# Altium project B100AA Development Kit.PrjPcb (part 3 of 5)

## Sheet Digital Port K Button.SchDoc: PORT State Change Buttons
size A4; ApprovedBy: Mehmet Günce Akkoyun; CheckedBy: Mehmet Günce Akkoyun; Author: Mehmet Günce Akkoyun; CompanyName: Ovoo Electronics; DrawnBy: Mehmet Günce Akkoyun; Engineer: Mehmet Günce Akkoyun; Organization: Ovoo Electronics; Address1: Necip Fazýl Mah. Ortaýrmak Sok.; Address2: Birgül Apt. No: 19/6; Address3: Meram / Konya; Address4: Turkiye; DocumentNumber: AA001; Revision: B100AA Dev Kit
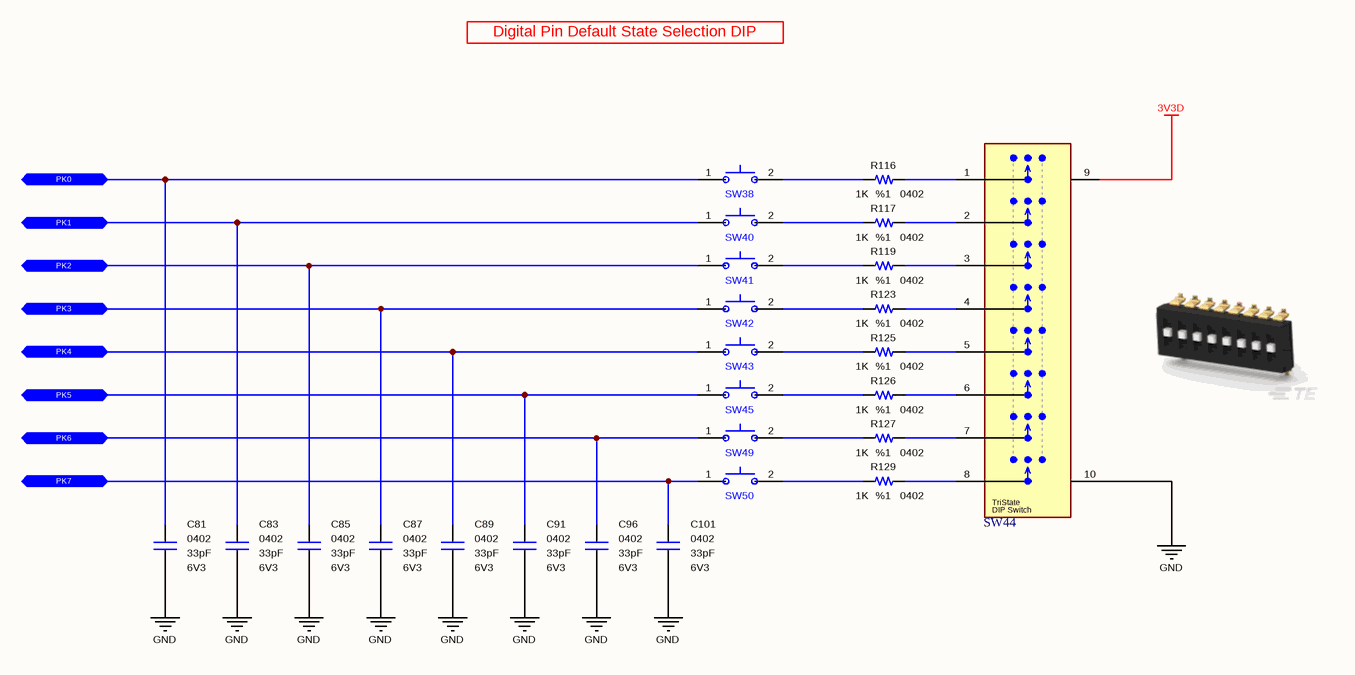
[diagram p17: Digital Port K Button.SchDoc]

### Parts
C81  value 33pF  Case: 0402  Voltage: 6V3  [CAPACITOR_0402]  (hidden comment: Multilayer Ceramic Capacitor)
C83  value 33pF  Case: 0402  Voltage: 6V3  [CAPACITOR_0402]  (hidden comment: Multilayer Ceramic Capacitor)
C85  value 33pF  Case: 0402  Voltage: 6V3  [CAPACITOR_0402]  (hidden comment: Multilayer Ceramic Capacitor)
C87  value 33pF  Case: 0402  Voltage: 6V3  [CAPACITOR_0402]  (hidden comment: Multilayer Ceramic Capacitor)
C89  value 33pF  Case: 0402  Voltage: 6V3  [CAPACITOR_0402]  (hidden comment: Multilayer Ceramic Capacitor)
C91  value 33pF  Case: 0402  Voltage: 6V3  [CAPACITOR_0402]  (hidden comment: Multilayer Ceramic Capacitor)
C96  value 33pF  Case: 0402  Voltage: 6V3  [CAPACITOR_0402]  (hidden comment: Multilayer Ceramic Capacitor)
C101  value 33pF  Case: 0402  Voltage: 6V3  [CAPACITOR_0402]  (hidden comment: Multilayer Ceramic Capacitor)
R116  value 1K  Tolerance: %1  Case: 0402  [RESISTOR_0402]  (hidden comment: Thick Film Resistor)
R117  value 1K  Tolerance: %1  Case: 0402  [RESISTOR_0402]  (hidden comment: Thick Film Resistor)
R119  value 1K  Tolerance: %1  Case: 0402  [RESISTOR_0402]  (hidden comment: Thick Film Resistor)
R123  value 1K  Tolerance: %1  Case: 0402  [RESISTOR_0402]  (hidden comment: Thick Film Resistor)
R125  value 1K  Tolerance: %1  Case: 0402  [RESISTOR_0402]  (hidden comment: Thick Film Resistor)
R126  value 1K  Tolerance: %1  Case: 0402  [RESISTOR_0402]  (hidden comment: Thick Film Resistor)
R127  value 1K  Tolerance: %1  Case: 0402  [RESISTOR_0402]  (hidden comment: Thick Film Resistor)
R129  value 1K  Tolerance: %1  Case: 0402  [RESISTOR_0402]  (hidden comment: Thick Film Resistor)
SW38  Tactile Switches  [PTS526_Switch]  (value not drawn)
SW40  Tactile Switches  [PTS526_Switch]  (value not drawn)
SW41  Tactile Switches  [PTS526_Switch]  (value not drawn)
SW42  Tactile Switches  [PTS526_Switch]  (value not drawn)
SW43  Tactile Switches  [PTS526_Switch]  (value not drawn)
SW44  DIP Switches/SIP Switches  [TDS08SGNNTR04]  (value not drawn)
SW45  Tactile Switches  [PTS526_Switch]  (value not drawn)
SW49  Tactile Switches  [PTS526_Switch]  (value not drawn)
SW50  Tactile Switches  [PTS526_Switch]  (value not drawn)

### Ports
PK0 (bidir), PK1 (bidir), PK2 (bidir), PK3 (bidir), PK4 (bidir), PK5 (bidir), PK6 (bidir), PK7 (bidir)

### Nets
3V3D: SW44.9(VCC)
GND: C81.1 C83.1 C85.1 C87.1 C89.1 C91.1 C96.1 C101.1 SW44.10(GND)
PK0: C81.2 SW38.1(NC) ; port PK0
PK1: C83.2 SW40.1(NC) ; port PK1
PK2: C85.2 SW41.1(NC) ; port PK2
PK3: C87.2 SW42.1(NC) ; port PK3
PK4: C89.2 SW43.1(NC) ; port PK4
PK5: C91.2 SW45.1(NC) ; port PK5
PK6: C96.2 SW49.1(NC) ; port PK6
PK7: C101.2 SW50.1(NC) ; port PK7
NetR116_1: R116.1 SW44.1
NetR116_2: R116.2 SW38.2(COM)
NetR117_1: R117.1 SW44.2
NetR117_2: R117.2 SW40.2(COM)
NetR119_1: R119.1 SW44.3
NetR119_2: R119.2 SW41.2(COM)
NetR123_1: R123.1 SW44.4
NetR123_2: R123.2 SW42.2(COM)
NetR125_1: R125.1 SW44.5
NetR125_2: R125.2 SW43.2(COM)
NetR126_1: R126.1 SW44.6
NetR126_2: R126.2 SW45.2(COM)
NetR127_1: R127.1 SW44.7
NetR127_2: R127.2 SW49.2(COM)
NetR129_1: R129.1 SW44.8
NetR129_2: R129.2 SW50.2(COM)

### Notes on the sheet
- Digital Pin Default State Selection DIP
- Title
- Size:
- Date:
- A4
- Number:
- Time:
- Revision:
- Sheet
- of
- File:
- (in symbol Switch - DIP Switch (8 Pole TriState)) TriState; DIP Switch

### Library data of the parts
C81 C83 C85 C87 C89 C91 C96 C101 = Capacitor - 33pF [0402-6V3]: as C50 on sheet Digital Port F State LED Inducator; Height: 0.5mm; Mouser Part Number: 80-C0402C330J9RAUTO; Maximum Operating Temperature: +125; Minimum Operating Temperature: -55; ROHS: Yes; ComponentLink1Description: DataSheet; ComponentLink1URL: https://api.kemet.com/component-edge/download/datasheet/C0402C330J9RACAUTO.pdf; ComponentLink2Description: Mouser; ComponentLink2URL: https://www.mouser.com/Search/Refine.aspx?Keyword=80-C0402C330J9RAUTO; Supplier 1: Mouser; Supplier Part Number 1: 80-C0402C330J9RAUTO
R116 R117 R119 R123 R125-R127 R129 = Resistor - 1K: Thick Film Resistors - SMD 1/16 W 1.0 Kohms 1%; Manufacturer Name: Vishay; Manufacturer Part Number: CRCW04021K00FKED; Height: 0.35mm; Mouser Part Number: 71-CRCW0402-1.0K-E3; ComponentLink1Description: DataSheet; ComponentLink1URL: https://www.mouser.com.tr/datasheet/2/427/dcrcwe3-1762152.pdf; ComponentLink2Description: Mouser; ComponentLink2URL: https://www.mouser.com.tr/ProductDetail/Vishay-Dale/CRCW04021K00FKED?qs=sGAEpiMZZMu61qfTUdNhG2DpbjADlD3GFJ4zSbeLqG8%3D; Supplier 1: Mouser; Supplier 2: Digi-Key; Supplier Part Number 1: 71-CRCW0402-1.0K-E3; Supplier Part Number 2: 541-1.00KLCT-ND
SW38 SW40-SW43 SW45 SW49 SW50 = Switch - Tactile: as SW28 on sheet Digital Port F Button; Height: 0.8mm; Mouser Part Number: 611-PTS526SK08SMTR2L; ComponentLink1Description: DataSheet; ComponentLink1URL: https://eu.mouser.com/datasheet/2/60/pts526-1651200.pdf; ComponentLink2Description: Mouser; ComponentLink2URL: https://eu.mouser.com/ProductDetail/CK/PTS526-SK08-SMTR2-LFS?qs=sGAEpiMZZMsgGjVA3toVBL%2FRce%252ByN3s1hQPqiLlQ%252BeM%3D; Supplier 1: Future Electronics; Supplier 2: Mouser; Supplier 3: Arrow; Supplier 4: Digi-Key; Supplier Part Number 1: PTS526SK08SMTR2LFS-REEL; Supplier Part Number 2: 611-PTS526SK08SMTR2L; Supplier Part Number 3: PTS526 SK08 SMTR2 LFS; Supplier Part Number 4: CKN12219-1-ND
SW44 = Switch - DIP Switch (8 Pole TriState): DIP Switches/SIP Switches TRI-STATE DIP 8P G RAISED T&R; Manufacturer Name: TE Connectivity; Manufacturer Part Number: TDS08SGNNTR04; Mouser Part Number: 506-TDS08SGNNTR04; ComponentLink1Description: DataSheet; ComponentLink1URL: https://www.mouser.com.tr/datasheet/2/418/4/NG_DS_1-1773931-8_ALCOSWITCH_DIP_TDS_0917-1221113.pdf; ComponentLink2Description: Mouser; ComponentLink2URL: https://www.mouser.com.tr/ProductDetail/TE-Connectivity-Alcoswitch/TDS08SGNNTR04/?qs=wd5RIQLrsJiLOOX2pWoyQw==

## Sheet Digital Port L.SchDoc: Port L Digital Control
size A4; ApprovedBy: Mehmet Günce Akkoyun; CheckedBy: Mehmet Günce Akkoyun; Author: Mehmet Günce Akkoyun; CompanyName: Ovoo Electronics; DrawnBy: Mehmet Günce Akkoyun; Engineer: Mehmet Günce Akkoyun; Organization: Ovoo Electronics; Address1: Necip Fazýl Mah. Ortaýrmak Sok.; Address2: Birgül Apt. No: 19/6; Address3: Meram / Konya; Address4: Turkiye; DocumentNumber: AA001; Revision: B100AA Dev Kit
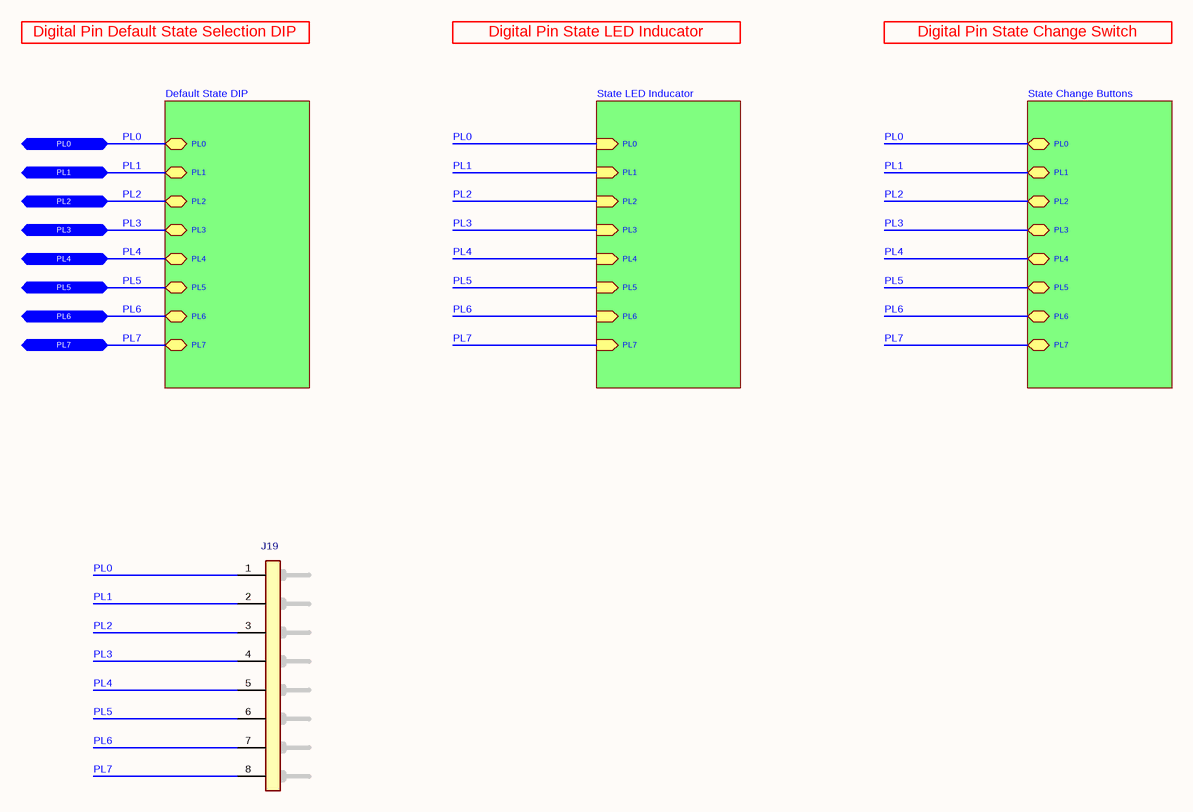
[diagram p18: Digital Port L.SchDoc]

### Parts
J19  2.54 mm Pitch 8P Male Connector  [8P Header]  (value not drawn)

### Sub-sheets
Default State DIP = Digital Port L Default State DIP.SchDoc: PL1 (bidir), PL0 (bidir), PL7 (bidir), PL4 (bidir), PL6 (bidir), PL3 (bidir), PL5 (bidir), PL2 (bidir)
State Change Buttons = Digital Port L Button.SchDoc: PL1 (bidir), PL0 (bidir), PL7 (bidir), PL4 (bidir), PL6 (bidir), PL3 (bidir), PL5 (bidir), PL2 (bidir)
State LED Inducator = Digital Port L State LED Inducator.SchDoc: PL1 (in), PL0 (in), PL7 (in), PL4 (in), PL6 (in), PL3 (in), PL5 (in), PL2 (in)

### Ports
PL0 (bidir), PL1 (bidir), PL2 (bidir), PL3 (bidir), PL4 (bidir), PL5 (bidir), PL6 (bidir), PL7 (bidir)

### Nets
PL0: J19.1(Pin-1) ; port PL0, sheet Default State DIP/PL0, sheet State LED Inducator/PL0, sheet State Change Buttons/PL0
PL1: J19.2(Pin-2) ; port PL1, sheet Default State DIP/PL1, sheet State LED Inducator/PL1, sheet State Change Buttons/PL1
PL2: J19.3(Pin-3) ; port PL2, sheet Default State DIP/PL2, sheet State LED Inducator/PL2, sheet State Change Buttons/PL2
PL3: J19.4(Pin-4) ; port PL3, sheet Default State DIP/PL3, sheet State LED Inducator/PL3, sheet State Change Buttons/PL3
PL4: J19.5(Pin-5) ; port PL4, sheet Default State DIP/PL4, sheet State LED Inducator/PL4, sheet State Change Buttons/PL4
PL5: J19.6(Pin-6) ; port PL5, sheet Default State DIP/PL5, sheet State LED Inducator/PL5, sheet State Change Buttons/PL5
PL6: J19.7(Pin-7) ; port PL6, sheet Default State DIP/PL6, sheet State LED Inducator/PL6, sheet State Change Buttons/PL6
PL7: J19.8(Pin-8) ; port PL7, sheet Default State DIP/PL7, sheet State LED Inducator/PL7, sheet State Change Buttons/PL7

### Notes on the sheet
- Digital Pin Default State Selection DIP
- Digital Pin State LED Inducator
- Digital Pin State Change Switch
- Title
- Size:
- Date:
- A4
- Number:
- Time:
- Revision:
- Sheet
- of
- File:

### Library data of the parts
J19 = Connector - Male Header 8P (2.54): Headers & Wire Housings BREAKAWAY HDR VERT 8; Manufacturer Name: Molex; Position: 8; Row: 1; Pitch: 2.54 mm; Manufacturer Part Number: 22-28-4083; Mouser Part Number: 538-22-28-4083; ROHS: Yes; ComponentLink1Description: DataSheet; ComponentLink1URL: https://www.mouser.com.tr/datasheet/2/276/0022284063_PCB_HEADERS-228265.pdf; ComponentLink2Description: Mouser; ComponentLink2URL: https://www.mouser.com.tr/ProductDetail/Molex/22-28-4083/?qs=%2Fha2pyFaduguMWEp6M%252Bj0x6fHxUvnRGD%252BIxBoa6MO5w%3D

## Sheet Digital Port L Default State DIP.SchDoc: PORT L Default State Selection Switch
size A4; ApprovedBy: Mehmet Günce Akkoyun; CheckedBy: Mehmet Günce Akkoyun; Author: Mehmet Günce Akkoyun; CompanyName: Ovoo Electronics; DrawnBy: Mehmet Günce Akkoyun; Engineer: Mehmet Günce Akkoyun; Organization: Ovoo Electronics; Address1: Necip Fazýl Mah. Ortaýrmak Sok.; Address2: Birgül Apt. No: 19/6; Address3: Meram / Konya; Address4: Turkiye; DocumentNumber: AA001; Revision: B100AA Dev Kit
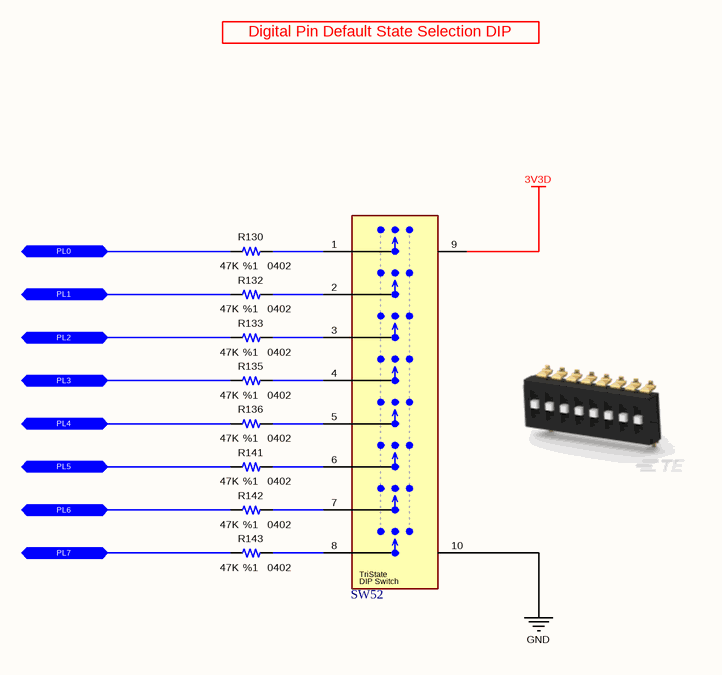
[diagram p19: Digital Port L Default State DIP.SchDoc]

### Parts
R130  value 47K  Tolerance: %1  Case: 0402  [RESISTOR_0402]  (hidden comment: Thick Film Resistor)
R132  value 47K  Tolerance: %1  Case: 0402  [RESISTOR_0402]  (hidden comment: Thick Film Resistor)
R133  value 47K  Tolerance: %1  Case: 0402  [RESISTOR_0402]  (hidden comment: Thick Film Resistor)
R135  value 47K  Tolerance: %1  Case: 0402  [RESISTOR_0402]  (hidden comment: Thick Film Resistor)
R136  value 47K  Tolerance: %1  Case: 0402  [RESISTOR_0402]  (hidden comment: Thick Film Resistor)
R141  value 47K  Tolerance: %1  Case: 0402  [RESISTOR_0402]  (hidden comment: Thick Film Resistor)
R142  value 47K  Tolerance: %1  Case: 0402  [RESISTOR_0402]  (hidden comment: Thick Film Resistor)
R143  value 47K  Tolerance: %1  Case: 0402  [RESISTOR_0402]  (hidden comment: Thick Film Resistor)
SW52  DIP Switches/SIP Switches  [TDS08SGNNTR04]  (value not drawn)

### Ports
PL0 (bidir), PL1 (bidir), PL2 (bidir), PL3 (bidir), PL4 (bidir), PL5 (bidir), PL6 (bidir), PL7 (bidir)

### Nets
3V3D: SW52.9(VCC)
GND: SW52.10(GND)
PL0: R130.2 ; port PL0
PL1: R132.2 ; port PL1
PL2: R133.2 ; port PL2
PL3: R135.2 ; port PL3
PL4: R136.2 ; port PL4
PL5: R141.2 ; port PL5
PL6: R142.2 ; port PL6
PL7: R143.2 ; port PL7
NetR130_1: R130.1 SW52.1
NetR132_1: R132.1 SW52.2
NetR133_1: R133.1 SW52.3
NetR135_1: R135.1 SW52.4
NetR136_1: R136.1 SW52.5
NetR141_1: R141.1 SW52.6
NetR142_1: R142.1 SW52.7
NetR143_1: R143.1 SW52.8

### Notes on the sheet
- Digital Pin Default State Selection DIP
- Title
- Size:
- Date:
- A4
- Number:
- Time:
- Revision:
- Sheet
- of
- File:
- (in symbol Switch - DIP Switch (8 Pole TriState)) TriState; DIP Switch

### Library data of the parts
R130 R132 R133 R135 R136 R141-R143 = Resistor - 47K: Thick Film Resistors - SMD 1/16 W 47 Kohms 1%; Manufacturer Name: Vishay; Manufacturer Part Number: CRCW040247K0FKED; Height: 0.4mm; Mouser Part Number: 71-CRCW0402-47K-E3; ComponentLink1Description: DataSheet; ComponentLink1URL: https://www.mouser.com.tr/datasheet/2/427/dcrcwe3-1762152.pdf; ComponentLink2Description: Mouser; ComponentLink2URL: https://www.mouser.com.tr/ProductDetail/Vishay-Dale/CRCW040247K0FKED?qs=sGAEpiMZZMu61qfTUdNhG2DpbjADlD3GL%252B3h1elTxqU%3D; Supplier 1: Mouser; Supplier 2: Digi-Key; Supplier Part Number 1: 71-CRCW040247K0FKEDH; Supplier Part Number 2: 541-47.0KYCT-ND
SW52 = Switch - DIP Switch (8 Pole TriState): as SW44 on sheet Digital Port K Button; Manufacturer Part Number: TDS08SGNNTR04; Mouser Part Number: 506-TDS08SGNNTR04; ComponentLink1Description: DataSheet; ComponentLink1URL: https://www.mouser.com.tr/datasheet/2/418/4/NG_DS_1-1773931-8_ALCOSWITCH_DIP_TDS_0917-1221113.pdf; ComponentLink2Description: Mouser; ComponentLink2URL: https://www.mouser.com.tr/ProductDetail/TE-Connectivity-Alcoswitch/TDS08SGNNTR04/?qs=wd5RIQLrsJiLOOX2pWoyQw==

## Sheet Digital Port L State LED Inducator.SchDoc: PORT State LED Inducator
size A3; ApprovedBy: Mehmet Günce Akkoyun; CheckedBy: Mehmet Günce Akkoyun; Author: Mehmet Günce Akkoyun; CompanyName: Ovoo Electronics; DrawnBy: Mehmet Günce Akkoyun; Engineer: Mehmet Günce Akkoyun; Organization: Ovoo Electronics; Address1: Necip Fazýl Mah. Ortaýrmak Sok.; Address2: Birgül Apt. No: 19/6; Address3: Meram / Konya; Address4: Turkiye; DocumentNumber: AA001; Revision: B100AA Dev Kit
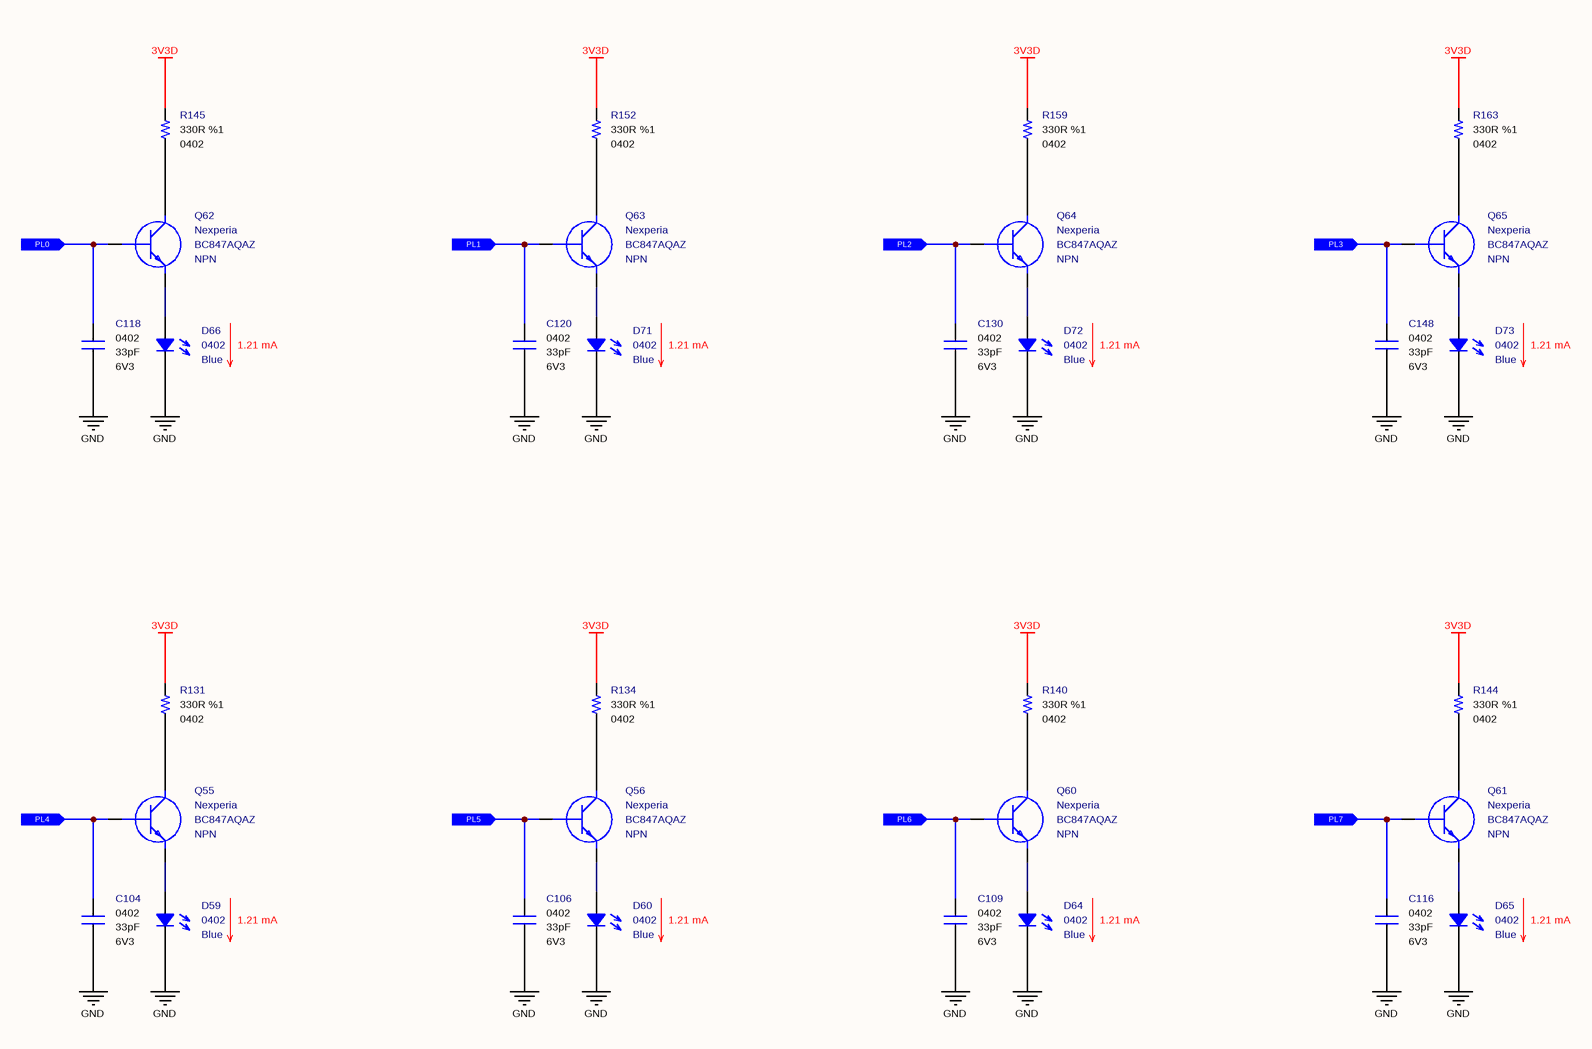
[diagram p20: Digital Port L State LED Inducator.SchDoc]

### Parts
C104  value 33pF  Case: 0402  Voltage: 6V3  [CAPACITOR_0402]  (hidden comment: Multilayer Ceramic Capacitor)
C106  value 33pF  Case: 0402  Voltage: 6V3  [CAPACITOR_0402]  (hidden comment: Multilayer Ceramic Capacitor)
C109  value 33pF  Case: 0402  Voltage: 6V3  [CAPACITOR_0402]  (hidden comment: Multilayer Ceramic Capacitor)
C116  value 33pF  Case: 0402  Voltage: 6V3  [CAPACITOR_0402]  (hidden comment: Multilayer Ceramic Capacitor)
C118  value 33pF  Case: 0402  Voltage: 6V3  [CAPACITOR_0402]  (hidden comment: Multilayer Ceramic Capacitor)
C120  value 33pF  Case: 0402  Voltage: 6V3  [CAPACITOR_0402]  (hidden comment: Multilayer Ceramic Capacitor)
C130  value 33pF  Case: 0402  Voltage: 6V3  [CAPACITOR_0402]  (hidden comment: Multilayer Ceramic Capacitor)
C148  value 33pF  Case: 0402  Voltage: 6V3  [CAPACITOR_0402]  (hidden comment: Multilayer Ceramic Capacitor)
D59  Case: 0402  Color: Blue  [LED_0402]  (hidden comment: SMD LED (Blue))
D60  Case: 0402  Color: Blue  [LED_0402]  (hidden comment: SMD LED (Blue))
D64  Case: 0402  Color: Blue  [LED_0402]  (hidden comment: SMD LED (Blue))
D65  Case: 0402  Color: Blue  [LED_0402]  (hidden comment: SMD LED (Blue))
D66  Case: 0402  Color: Blue  [LED_0402]  (hidden comment: SMD LED (Blue))
D71  Case: 0402  Color: Blue  [LED_0402]  (hidden comment: SMD LED (Blue))
D72  Case: 0402  Color: Blue  [LED_0402]  (hidden comment: SMD LED (Blue))
D73  Case: 0402  Color: Blue  [LED_0402]  (hidden comment: SMD LED (Blue))
Q55  Manufacturer_Name: Nexperia  Manufacturer_Part_Number: BC847AQAZ  Polarity: NPN  [SOT1215]  (hidden comment: Bipolar NPN Transistors)
Q56  Manufacturer_Name: Nexperia  Manufacturer_Part_Number: BC847AQAZ  Polarity: NPN  [SOT1215]  (hidden comment: Bipolar NPN Transistors)
Q60  Manufacturer_Name: Nexperia  Manufacturer_Part_Number: BC847AQAZ  Polarity: NPN  [SOT1215]  (hidden comment: Bipolar NPN Transistors)
Q61  Manufacturer_Name: Nexperia  Manufacturer_Part_Number: BC847AQAZ  Polarity: NPN  [SOT1215]  (hidden comment: Bipolar NPN Transistors)
Q62  Manufacturer_Name: Nexperia  Manufacturer_Part_Number: BC847AQAZ  Polarity: NPN  [SOT1215]  (hidden comment: Bipolar NPN Transistors)
Q63  Manufacturer_Name: Nexperia  Manufacturer_Part_Number: BC847AQAZ  Polarity: NPN  [SOT1215]  (hidden comment: Bipolar NPN Transistors)
Q64  Manufacturer_Name: Nexperia  Manufacturer_Part_Number: BC847AQAZ  Polarity: NPN  [SOT1215]  (hidden comment: Bipolar NPN Transistors)
Q65  Manufacturer_Name: Nexperia  Manufacturer_Part_Number: BC847AQAZ  Polarity: NPN  [SOT1215]  (hidden comment: Bipolar NPN Transistors)
R131  value 330R  Tolerance: %1  Case: 0402  [RESISTOR_0402]  (hidden comment: Thick Film Resistor)
R134  value 330R  Tolerance: %1  Case: 0402  [RESISTOR_0402]  (hidden comment: Thick Film Resistor)
R140  value 330R  Tolerance: %1  Case: 0402  [RESISTOR_0402]  (hidden comment: Thick Film Resistor)
R144  value 330R  Tolerance: %1  Case: 0402  [RESISTOR_0402]  (hidden comment: Thick Film Resistor)
R145  value 330R  Tolerance: %1  Case: 0402  [RESISTOR_0402]  (hidden comment: Thick Film Resistor)
R152  value 330R  Tolerance: %1  Case: 0402  [RESISTOR_0402]  (hidden comment: Thick Film Resistor)
R159  value 330R  Tolerance: %1  Case: 0402  [RESISTOR_0402]  (hidden comment: Thick Film Resistor)
R163  value 330R  Tolerance: %1  Case: 0402  [RESISTOR_0402]  (hidden comment: Thick Film Resistor)

### Ports
PL0 (in), PL1 (in), PL2 (in), PL3 (in), PL4 (in), PL5 (in), PL6 (in), PL7 (in)

### Nets
3V3D: R131.2 R134.2 R140.2 R144.2 R145.2 R152.2 R159.2 R163.2
GND: C104.2 C106.2 C109.2 C116.2 C118.2 C120.2 C130.2 C148.2 D59.1 D60.1 D64.1 D65.1 D66.1 D71.1 D72.1 D73.1
PL0: C118.1 Q62.1(B) ; port PL0
PL1: C120.1 Q63.1(B) ; port PL1
PL2: C130.1 Q64.1(B) ; port PL2
PL3: C148.1 Q65.1(B) ; port PL3
PL4: C104.1 Q55.1(B) ; port PL4
PL5: C106.1 Q56.1(B) ; port PL5
PL6: C109.1 Q60.1(B) ; port PL6
PL7: C116.1 Q61.1(B) ; port PL7
NetD59_2: D59.2 Q55.2(E)
NetD60_2: D60.2 Q56.2(E)
NetD64_2: D64.2 Q60.2(E)
NetD65_2: D65.2 Q61.2(E)
NetD66_2: D66.2 Q62.2(E)
NetD71_2: D71.2 Q63.2(E)
NetD72_2: D72.2 Q64.2(E)
NetD73_2: D73.2 Q65.2(E)
NetQ55_3: Q55.3(C) R131.1
NetQ56_3: Q56.3(C) R134.1
NetQ60_3: Q60.3(C) R140.1
NetQ61_3: Q61.3(C) R144.1
NetQ62_3: Q62.3(C) R145.1
NetQ63_3: Q63.3(C) R152.1
NetQ64_3: Q64.3(C) R159.1
NetQ65_3: Q65.3(C) R163.1

### Notes on the sheet
- 1.21 mA
- Title
- Size:
- Date:
- A3
- Number:
- Time:
- Revision:
- Sheet
- of
- File:

### Library data of the parts
C104 C106 C109 C116 C118 C120 C130 C148 = Capacitor - 33pF [0402-6V3]: as C50 on sheet Digital Port F State LED Inducator; Height: 0.5mm; Maximum Operating Temperature: +125; Minimum Operating Temperature: -55; ROHS: Yes; ComponentLink1Description: DataSheet; ComponentLink1URL: https://api.kemet.com/component-edge/download/datasheet/C0402C330J9RACAUTO.pdf; ComponentLink2Description: Mouser; ComponentLink2URL: https://www.mouser.com/Search/Refine.aspx?Keyword=80-C0402C330J9RAUTO; Supplier 1: Mouser; Supplier Part Number 1: 80-C0402C330J9RAUTO; Mouser Part Number: 80-C0402C330J9RAUTO
D59 D60 D64-D66 D71-D73 = Diode - LED (0402-Blue): as D29 on sheet Digital Port F State LED Inducator; Mouser_Part_Number: 755-SMLP13BC8TT86; ROHS: Yes; ComponentLink1Description: DataSheet; ComponentLink1URL: https://d1d2qsbl8m0m72.cloudfront.net/en/products/databook/datasheet/opto/led/chip_mono/sml-p1-e.pdf; ComponentLink2Description: Mouser; ComponentLink2URL: https://www.mouser.com.tr/ProductDetail/ROHM-Semiconductor/SMLP13BC8TT86?qs=%2Fha2pyFaduidYDgXFKL%252BNZwCVZNUI4FlyPWWbVDx1b6ABmzS%252BS2f0w%3D%3D; Supplier 1: Mouser; Supplier 2: Digi-Key; Supplier Part Number 1: 755-SMLP13BC8TT86; Supplier Part Number 2: 846-1112-1-ND
Q55 Q56 Q60-Q65 = Transistor - BC847: as Q25-Q27 on sheet Digital Port F State LED Inducator; Mouser_Part_Number: 771-BC847AQAZ; ComponentLink1Description: DataSheet; ComponentLink1URL: https://www.mouser.com.tr/datasheet/2/916/BC847XQA_SER-1598405.pdf; ComponentLink2Description: Mouser; ComponentLink2URL: https://www.mouser.com.tr/ProductDetail/Nexperia/BC847AQAZ?qs=%2Fha2pyFaduhKMCPKNtQimeJpXTw9z4AqURd2YARs8DVICZNv3AT9Dw%3D%3D; Case: DFN-1010D-3; Supplier 1: Mouser; Supplier 2: Digi-Key; Supplier Part Number 1: 771-BC847AQAZ; Supplier Part Number 2: 1727-2545-1-ND
R131 R134 R140 R144 R145 R152 R159 R163 = Resistor - 330R: as R69 on sheet Digital Port F State LED Inducator; Height: 0.4mm; ComponentLink1Description: DataSheet; ComponentLink1URL: https://www.mouser.com.tr/datasheet/2/427/dcrcwe3-1762152.pdf; ComponentLink2Description: Mouser; ComponentLink2URL: https://www.mouser.com.tr/ProductDetail/Vishay-Dale/CRCW0402330RFKED?qs=sGAEpiMZZMu61qfTUdNhG2DpbjADlD3GGS6SwBlLi5Q%3D; Supplier 1: Mouser; Supplier 2: Digi-Key; Supplier Part Number 2: 541-330LCT-ND; Supplier Part Number 1: 71-CRCW0402-330-E3; Mouser Part Number: 71-CRCW0402-330-E3

## Sheet Digital Port L Button.SchDoc: PORT State Change Buttons
size A4; ApprovedBy: Mehmet Günce Akkoyun; CheckedBy: Mehmet Günce Akkoyun; Author: Mehmet Günce Akkoyun; CompanyName: Ovoo Electronics; DrawnBy: Mehmet Günce Akkoyun; Engineer: Mehmet Günce Akkoyun; Organization: Ovoo Electronics; Address1: Necip Fazýl Mah. Ortaýrmak Sok.; Address2: Birgül Apt. No: 19/6; Address3: Meram / Konya; Address4: Turkiye; DocumentNumber: AA001; Revision: B100AA Dev Kit
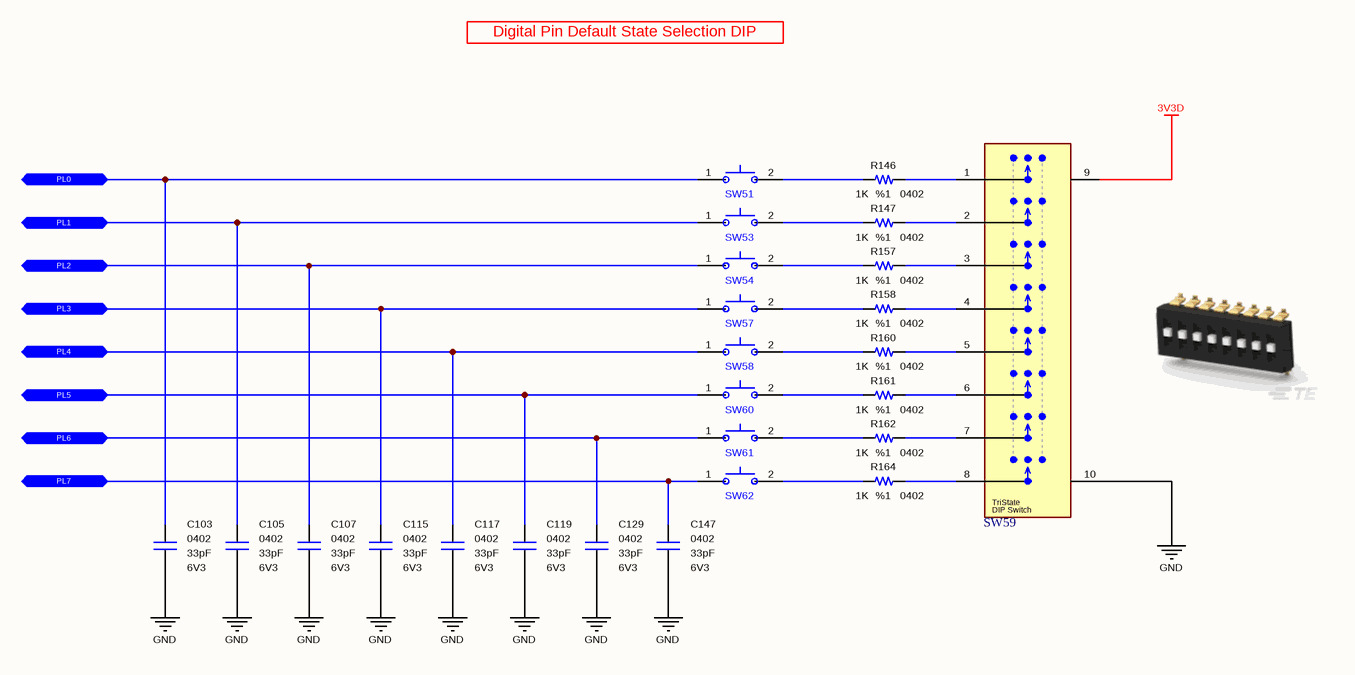
[diagram p21: Digital Port L Button.SchDoc]

### Parts
C103  value 33pF  Case: 0402  Voltage: 6V3  [CAPACITOR_0402]  (hidden comment: Multilayer Ceramic Capacitor)
C105  value 33pF  Case: 0402  Voltage: 6V3  [CAPACITOR_0402]  (hidden comment: Multilayer Ceramic Capacitor)
C107  value 33pF  Case: 0402  Voltage: 6V3  [CAPACITOR_0402]  (hidden comment: Multilayer Ceramic Capacitor)
C115  value 33pF  Case: 0402  Voltage: 6V3  [CAPACITOR_0402]  (hidden comment: Multilayer Ceramic Capacitor)
C117  value 33pF  Case: 0402  Voltage: 6V3  [CAPACITOR_0402]  (hidden comment: Multilayer Ceramic Capacitor)
C119  value 33pF  Case: 0402  Voltage: 6V3  [CAPACITOR_0402]  (hidden comment: Multilayer Ceramic Capacitor)
C129  value 33pF  Case: 0402  Voltage: 6V3  [CAPACITOR_0402]  (hidden comment: Multilayer Ceramic Capacitor)
C147  value 33pF  Case: 0402  Voltage: 6V3  [CAPACITOR_0402]  (hidden comment: Multilayer Ceramic Capacitor)
R146  value 1K  Tolerance: %1  Case: 0402  [RESISTOR_0402]  (hidden comment: Thick Film Resistor)
R147  value 1K  Tolerance: %1  Case: 0402  [RESISTOR_0402]  (hidden comment: Thick Film Resistor)
R157  value 1K  Tolerance: %1  Case: 0402  [RESISTOR_0402]  (hidden comment: Thick Film Resistor)
R158  value 1K  Tolerance: %1  Case: 0402  [RESISTOR_0402]  (hidden comment: Thick Film Resistor)
R160  value 1K  Tolerance: %1  Case: 0402  [RESISTOR_0402]  (hidden comment: Thick Film Resistor)
R161  value 1K  Tolerance: %1  Case: 0402  [RESISTOR_0402]  (hidden comment: Thick Film Resistor)
R162  value 1K  Tolerance: %1  Case: 0402  [RESISTOR_0402]  (hidden comment: Thick Film Resistor)
R164  value 1K  Tolerance: %1  Case: 0402  [RESISTOR_0402]  (hidden comment: Thick Film Resistor)
SW51  Tactile Switches  [PTS526_Switch]  (value not drawn)
SW53  Tactile Switches  [PTS526_Switch]  (value not drawn)
SW54  Tactile Switches  [PTS526_Switch]  (value not drawn)
SW57  Tactile Switches  [PTS526_Switch]  (value not drawn)
SW58  Tactile Switches  [PTS526_Switch]  (value not drawn)
SW59  DIP Switches/SIP Switches  [TDS08SGNNTR04]  (value not drawn)
SW60  Tactile Switches  [PTS526_Switch]  (value not drawn)
SW61  Tactile Switches  [PTS526_Switch]  (value not drawn)
SW62  Tactile Switches  [PTS526_Switch]  (value not drawn)

### Ports
PL0 (bidir), PL1 (bidir), PL2 (bidir), PL3 (bidir), PL4 (bidir), PL5 (bidir), PL6 (bidir), PL7 (bidir)

### Nets
3V3D: SW59.9(VCC)
GND: C103.1 C105.1 C107.1 C115.1 C117.1 C119.1 C129.1 C147.1 SW59.10(GND)
PL0: C103.2 SW51.1(NC) ; port PL0
PL1: C105.2 SW53.1(NC) ; port PL1
PL2: C107.2 SW54.1(NC) ; port PL2
PL3: C115.2 SW57.1(NC) ; port PL3
PL4: C117.2 SW58.1(NC) ; port PL4
PL5: C119.2 SW60.1(NC) ; port PL5
PL6: C129.2 SW61.1(NC) ; port PL6
PL7: C147.2 SW62.1(NC) ; port PL7
NetR146_1: R146.1 SW59.1
NetR146_2: R146.2 SW51.2(COM)
NetR147_1: R147.1 SW59.2
NetR147_2: R147.2 SW53.2(COM)
NetR157_1: R157.1 SW59.3
NetR157_2: R157.2 SW54.2(COM)
NetR158_1: R158.1 SW59.4
NetR158_2: R158.2 SW57.2(COM)
NetR160_1: R160.1 SW59.5
NetR160_2: R160.2 SW58.2(COM)
NetR161_1: R161.1 SW59.6
NetR161_2: R161.2 SW60.2(COM)
NetR162_1: R162.1 SW59.7
NetR162_2: R162.2 SW61.2(COM)
NetR164_1: R164.1 SW59.8
NetR164_2: R164.2 SW62.2(COM)

### Notes on the sheet
- Digital Pin Default State Selection DIP
- Title
- Size:
- Date:
- A4
- Number:
- Time:
- Revision:
- Sheet
- of
- File:
- (in symbol Switch - DIP Switch (8 Pole TriState)) TriState; DIP Switch

### Library data of the parts
C103 C105 C107 C115 C117 C119 C129 C147 = Capacitor - 33pF [0402-6V3]: as C50 on sheet Digital Port F State LED Inducator; Height: 0.5mm; Mouser Part Number: 80-C0402C330J9RAUTO; Maximum Operating Temperature: +125; Minimum Operating Temperature: -55; ROHS: Yes; ComponentLink1Description: DataSheet; ComponentLink1URL: https://api.kemet.com/component-edge/download/datasheet/C0402C330J9RACAUTO.pdf; ComponentLink2Description: Mouser; ComponentLink2URL: https://www.mouser.com/Search/Refine.aspx?Keyword=80-C0402C330J9RAUTO; Supplier 1: Mouser; Supplier Part Number 1: 80-C0402C330J9RAUTO
R146 R147 R157 R158 R160-R162 R164 = Resistor - 1K: as R116 on sheet Digital Port K Button; Height: 0.35mm; Mouser Part Number: 71-CRCW0402-1.0K-E3; ComponentLink1Description: DataSheet; ComponentLink1URL: https://www.mouser.com.tr/datasheet/2/427/dcrcwe3-1762152.pdf; ComponentLink2Description: Mouser; ComponentLink2URL: https://www.mouser.com.tr/ProductDetail/Vishay-Dale/CRCW04021K00FKED?qs=sGAEpiMZZMu61qfTUdNhG2DpbjADlD3GFJ4zSbeLqG8%3D; Supplier 1: Mouser; Supplier 2: Digi-Key; Supplier Part Number 1: 71-CRCW0402-1.0K-E3; Supplier Part Number 2: 541-1.00KLCT-ND
SW51 SW53 SW54 SW57 SW58 SW60-SW62 = Switch - Tactile: as SW28 on sheet Digital Port F Button; Height: 0.8mm; Mouser Part Number: 611-PTS526SK08SMTR2L; ComponentLink1Description: DataSheet; ComponentLink1URL: https://eu.mouser.com/datasheet/2/60/pts526-1651200.pdf; ComponentLink2Description: Mouser; ComponentLink2URL: https://eu.mouser.com/ProductDetail/CK/PTS526-SK08-SMTR2-LFS?qs=sGAEpiMZZMsgGjVA3toVBL%2FRce%252ByN3s1hQPqiLlQ%252BeM%3D; Supplier 1: Future Electronics; Supplier 2: Mouser; Supplier 3: Arrow; Supplier 4: Digi-Key; Supplier Part Number 1: PTS526SK08SMTR2LFS-REEL; Supplier Part Number 2: 611-PTS526SK08SMTR2L; Supplier Part Number 3: PTS526 SK08 SMTR2 LFS; Supplier Part Number 4: CKN12219-1-ND
SW59 = Switch - DIP Switch (8 Pole TriState): as SW44 on sheet Digital Port K Button; Manufacturer Part Number: TDS08SGNNTR04; Mouser Part Number: 506-TDS08SGNNTR04; ComponentLink1Description: DataSheet; ComponentLink1URL: https://www.mouser.com.tr/datasheet/2/418/4/NG_DS_1-1773931-8_ALCOSWITCH_DIP_TDS_0917-1221113.pdf; ComponentLink2Description: Mouser; ComponentLink2URL: https://www.mouser.com.tr/ProductDetail/TE-Connectivity-Alcoswitch/TDS08SGNNTR04/?qs=wd5RIQLrsJiLOOX2pWoyQw==

## Sheet External SIM Tray.SchDoc: External SIM Tray
size A4; ApprovedBy: Mehmet Günce Akkoyun; CheckedBy: Mehmet Günce Akkoyun; Author: Mehmet Günce Akkoyun; CompanyName: Ovoo Electronics; DrawnBy: Mehmet Günce Akkoyun; Engineer: Mehmet Günce Akkoyun; Organization: Ovoo Electronics; Address1: Necip Fazýl Mah. Ortaýrmak Sok.; Address2: Birgül Apt. No: 19/6; Address3: Meram / Konya; Address4: Turkiye; DocumentNumber: AA001; Revision: B100AA Dev Kit
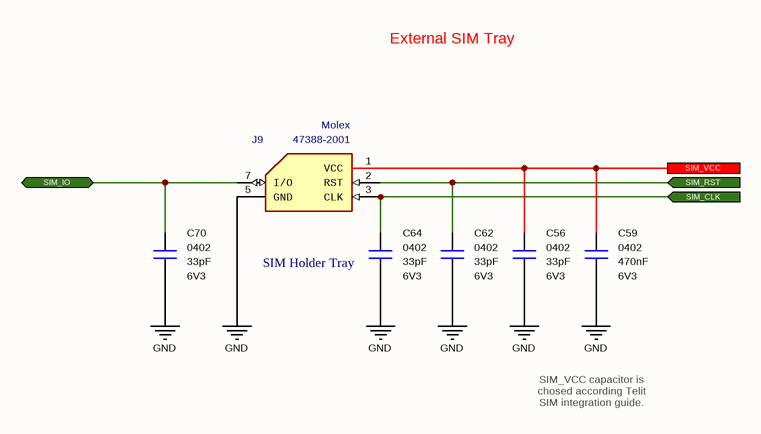
[diagram p22: External SIM Tray.SchDoc]

### Parts
C56  value 33pF  Case: 0402  Voltage: 6V3  [CAPACITOR_0402]  (hidden comment: Multilayer Ceramic Capacitor)
C59  value 470nF  Case: 0402  Voltage: 6V3  [CAPACITOR_0402]  (hidden comment: Multilayer Ceramic Capacitor)
C62  value 33pF  Case: 0402  Voltage: 6V3  [CAPACITOR_0402]  (hidden comment: Multilayer Ceramic Capacitor)
C64  value 33pF  Case: 0402  Voltage: 6V3  [CAPACITOR_0402]  (hidden comment: Multilayer Ceramic Capacitor)
C70  value 33pF  Case: 0402  Voltage: 6V3  [CAPACITOR_0402]  (hidden comment: Multilayer Ceramic Capacitor)
J9  SIM Holder Tray  Manufacturer_Name: Molex  Manufacturer_Part_Number: 47388-2001  [Connector - SIM Tray]

### Ports
SIM_CLK (in), SIM_IO (bidir), SIM_RST (in), SIM_VCC

### Nets
GND: C56.1 C59.1 C62.1 C64.1 C70.1 J9.5(GND)
NetC56_2: C56.2 C59.2 J9.1(VCC) ; port SIM_VCC
NetC62_2: C62.2 J9.2(RST) ; port SIM_RST
NetC64_2: C64.2 J9.3(CLK) ; port SIM_CLK
NetC70_2: C70.2 J9.7(I/O) ; port SIM_IO

### Notes on the sheet
- External SIM Tray
- SIM_VCC capacitor is chosed according Telit SIM integration guide.
- Title
- Size:
- Date:
- A4
- Number:
- Time:
- Revision:
- Sheet
- of
- File:

### Library data of the parts
C56 C62 C64 C70 = Capacitor - 33pF [0402-6V3]: as C50 on sheet Digital Port F State LED Inducator; Height: 0.5mm; Mouser Part Number: 80-C0402C330J9RAUTO; Maximum Operating Temperature: +125; Minimum Operating Temperature: -55; ROHS: Yes; ComponentLink1Description: DataSheet; ComponentLink1URL: https://api.kemet.com/component-edge/download/datasheet/C0402C330J9RACAUTO.pdf; ComponentLink2Description: Mouser; ComponentLink2URL: https://www.mouser.com/Search/Refine.aspx?Keyword=80-C0402C330J9RAUTO; Supplier 1: Mouser; Supplier Part Number 1: 80-C0402C330J9RAUTO
C59 = Capacitor - 470nF [0402-6V3]: Capacitor - 470nF [0402] (Ceramic); Manufacturer Name: AVX; Manufacturer Part Number: 04026C474KAT2A; Dielectric: X7R; Tolerance: %10; Height: 0.4mm; Mouser Part Number: 581-04026C474KAT2A; ComponentLink1Description: Mouser; ComponentLink1URL: https://www.mouser.com.tr/ProductDetail/AVX/04026D104KAT4A?qs=sGAEpiMZZMs0AnBnWHyRQPg4iYkCw7IMED%2F4kpqgf7w%3D; ComponentLink2Description: DataSheet; ComponentLink2URL: https://www.mouser.com.tr/datasheet/2/40/cx5r-776519.pdf; ROHS: Yes; Maximum Operating Temperature: +125; Minimum Operating Temperature: -55; Supplier 1: Mouser; Supplier Part Number 1: 581-04026C474KAT2A
J9 = Connector - Sim Holder: Memory Card Connectors ASSY 1.90 SIM CARD R IM CARD READER CONN.; Card Type: Mini SIM; Mouser_Part_Number: 538-47388-2001; Supplier 1: Arrow; Supplier 2: Mouser; Supplier 3: Farnell; Supplier Part Number 1: 47388-2001; Supplier Part Number 2: 538-47388-2001; Supplier Part Number 3: 2426322

## Sheet GSM Communication Signals.SchDoc: GSM Communication Signals
size A3; ApprovedBy: Mehmet Günce Akkoyun; CheckedBy: Mehmet Günce Akkoyun; Author: Mehmet Günce Akkoyun; CompanyName: Ovoo Electronics; DrawnBy: Mehmet Günce Akkoyun; Engineer: Mehmet Günce Akkoyun; Organization: Ovoo Electronics; Address1: Necip Fazýl Mah. Ortaýrmak Sok.; Address2: Birgül Apt. No: 19/6; Address3: Meram / Konya; Address4: Turkiye; DocumentNumber: AA001; Revision: B100AA Dev Kit
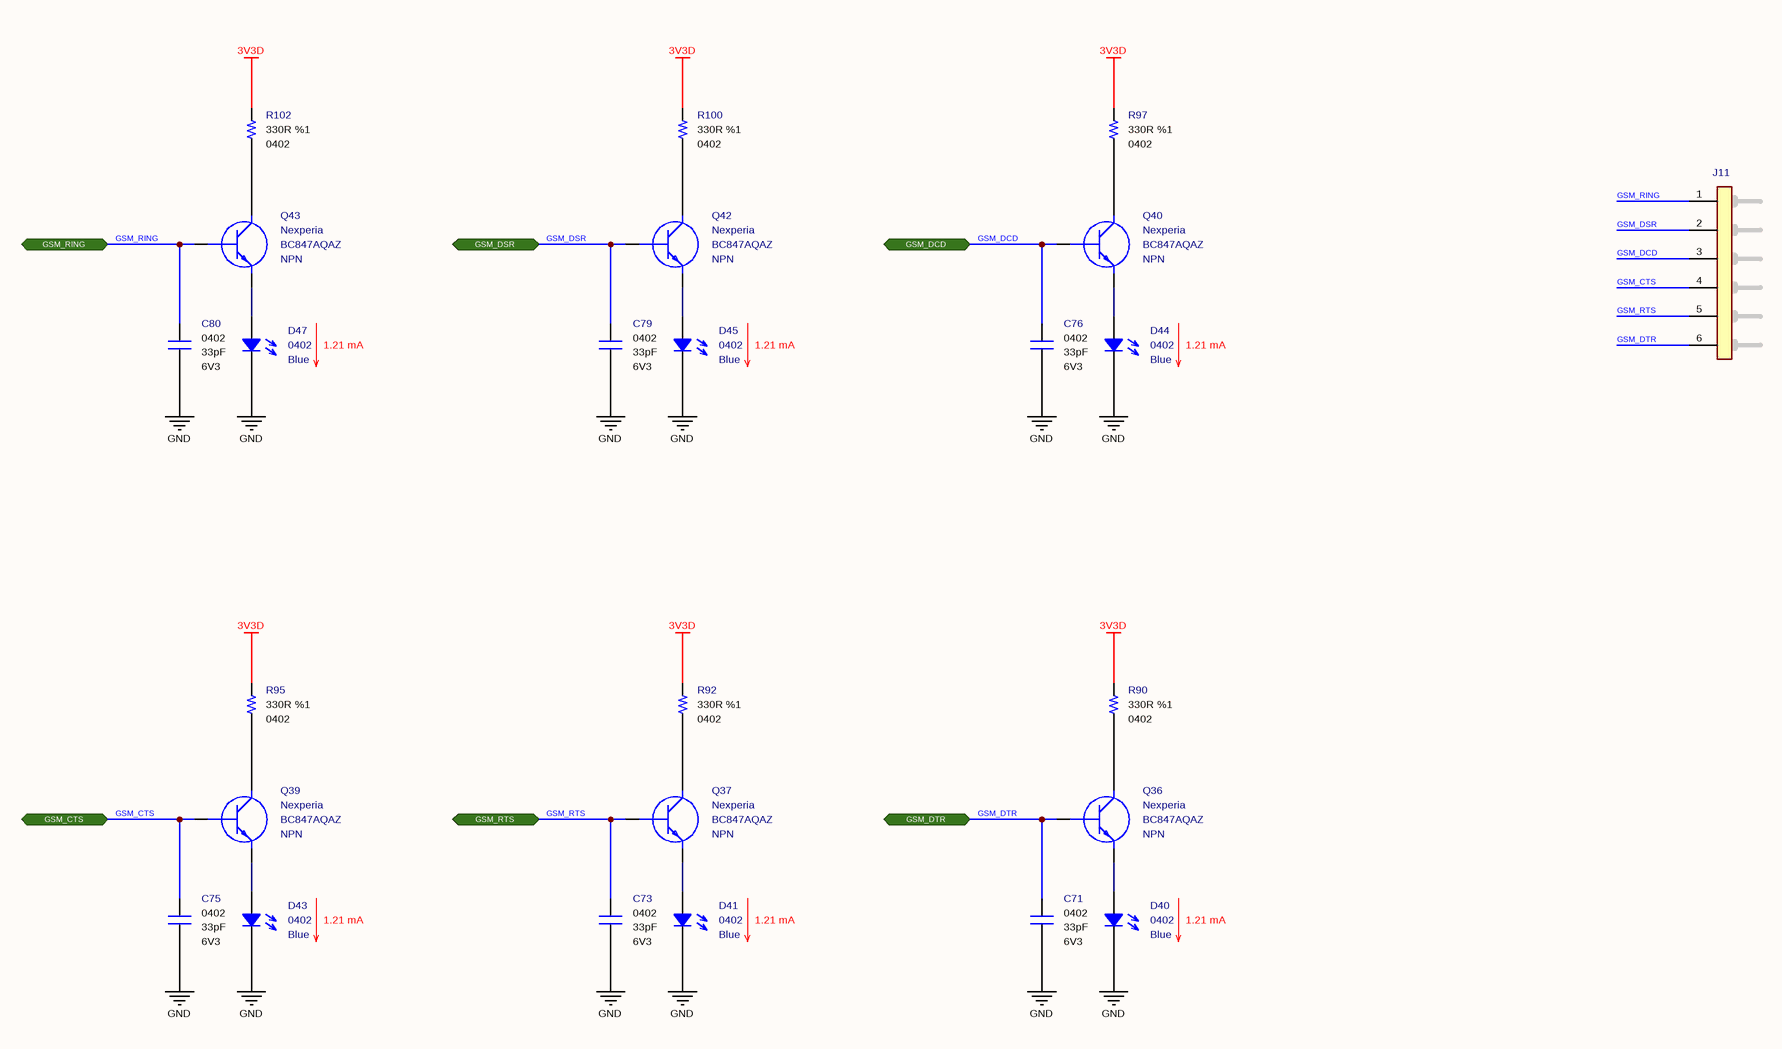
[diagram p23: GSM Communication Signals.SchDoc]

### Parts
C71  value 33pF  Case: 0402  Voltage: 6V3  [CAPACITOR_0402]  (hidden comment: Multilayer Ceramic Capacitor)
C73  value 33pF  Case: 0402  Voltage: 6V3  [CAPACITOR_0402]  (hidden comment: Multilayer Ceramic Capacitor)
C75  value 33pF  Case: 0402  Voltage: 6V3  [CAPACITOR_0402]  (hidden comment: Multilayer Ceramic Capacitor)
C76  value 33pF  Case: 0402  Voltage: 6V3  [CAPACITOR_0402]  (hidden comment: Multilayer Ceramic Capacitor)
C79  value 33pF  Case: 0402  Voltage: 6V3  [CAPACITOR_0402]  (hidden comment: Multilayer Ceramic Capacitor)
C80  value 33pF  Case: 0402  Voltage: 6V3  [CAPACITOR_0402]  (hidden comment: Multilayer Ceramic Capacitor)
D40  Case: 0402  Color: Blue  [LED_0402]  (hidden comment: SMD LED (Blue))
D41  Case: 0402  Color: Blue  [LED_0402]  (hidden comment: SMD LED (Blue))
D43  Case: 0402  Color: Blue  [LED_0402]  (hidden comment: SMD LED (Blue))
D44  Case: 0402  Color: Blue  [LED_0402]  (hidden comment: SMD LED (Blue))
D45  Case: 0402  Color: Blue  [LED_0402]  (hidden comment: SMD LED (Blue))
D47  Case: 0402  Color: Blue  [LED_0402]  (hidden comment: SMD LED (Blue))
J11  2.54 mm Pitch 6P Male Connector  [6P Header]  (value not drawn)
Q36  Manufacturer_Name: Nexperia  Manufacturer_Part_Number: BC847AQAZ  Polarity: NPN  [SOT1215]  (hidden comment: Bipolar NPN Transistors)
Q37  Manufacturer_Name: Nexperia  Manufacturer_Part_Number: BC847AQAZ  Polarity: NPN  [SOT1215]  (hidden comment: Bipolar NPN Transistors)
Q39  Manufacturer_Name: Nexperia  Manufacturer_Part_Number: BC847AQAZ  Polarity: NPN  [SOT1215]  (hidden comment: Bipolar NPN Transistors)
Q40  Manufacturer_Name: Nexperia  Manufacturer_Part_Number: BC847AQAZ  Polarity: NPN  [SOT1215]  (hidden comment: Bipolar NPN Transistors)
Q42  Manufacturer_Name: Nexperia  Manufacturer_Part_Number: BC847AQAZ  Polarity: NPN  [SOT1215]  (hidden comment: Bipolar NPN Transistors)
Q43  Manufacturer_Name: Nexperia  Manufacturer_Part_Number: BC847AQAZ  Polarity: NPN  [SOT1215]  (hidden comment: Bipolar NPN Transistors)
R90  value 330R  Tolerance: %1  Case: 0402  [RESISTOR_0402]  (hidden comment: Thick Film Resistor)
R92  value 330R  Tolerance: %1  Case: 0402  [RESISTOR_0402]  (hidden comment: Thick Film Resistor)
R95  value 330R  Tolerance: %1  Case: 0402  [RESISTOR_0402]  (hidden comment: Thick Film Resistor)
R97  value 330R  Tolerance: %1  Case: 0402  [RESISTOR_0402]  (hidden comment: Thick Film Resistor)
R100  value 330R  Tolerance: %1  Case: 0402  [RESISTOR_0402]  (hidden comment: Thick Film Resistor)
R102  value 330R  Tolerance: %1  Case: 0402  [RESISTOR_0402]  (hidden comment: Thick Film Resistor)

### Ports
GSM_CTS (bidir), GSM_DCD (bidir), GSM_DSR (bidir), GSM_DTR (bidir), GSM_RING (bidir), GSM_RTS (bidir)

### Nets
3V3D: R90.2 R92.2 R95.2 R97.2 R100.2 R102.2
GND: C71.2 C73.2 C75.2 C76.2 C79.2 C80.2 D40.1 D41.1 D43.1 D44.1 D45.1 D47.1
GSM_CTS: C75.1 J11.4(Pin-4) Q39.1(B) ; port GSM_CTS
GSM_DCD: C76.1 J11.3(Pin-3) Q40.1(B) ; port GSM_DCD
GSM_DSR: C79.1 J11.2(Pin-2) Q42.1(B) ; port GSM_DSR
GSM_DTR: C71.1 J11.6(Pin-6) Q36.1(B) ; port GSM_DTR
GSM_RING: C80.1 J11.1(Pin-1) Q43.1(B) ; port GSM_RING
GSM_RTS: C73.1 J11.5(Pin-5) Q37.1(B) ; port GSM_RTS
NetD40_2: D40.2 Q36.2(E)
NetD41_2: D41.2 Q37.2(E)
NetD43_2: D43.2 Q39.2(E)
NetD44_2: D44.2 Q40.2(E)
NetD45_2: D45.2 Q42.2(E)
NetD47_2: D47.2 Q43.2(E)
NetQ36_3: Q36.3(C) R90.1
NetQ37_3: Q37.3(C) R92.1
NetQ39_3: Q39.3(C) R95.1
NetQ40_3: Q40.3(C) R97.1
NetQ42_3: Q42.3(C) R100.1
NetQ43_3: Q43.3(C) R102.1

### Notes on the sheet
- 1.21 mA
- Title
- Size:
- Date:
- A3
- Number:
- Time:
- Revision:
- Sheet
- of
- File:

### Library data of the parts
C71 C73 C75 C76 C79 C80 = Capacitor - 33pF [0402-6V3]: as C50 on sheet Digital Port F State LED Inducator; Height: 0.5mm; Maximum Operating Temperature: +125; Minimum Operating Temperature: -55; ROHS: Yes; ComponentLink1Description: DataSheet; ComponentLink1URL: https://api.kemet.com/component-edge/download/datasheet/C0402C330J9RACAUTO.pdf; ComponentLink2Description: Mouser; ComponentLink2URL: https://www.mouser.com/Search/Refine.aspx?Keyword=80-C0402C330J9RAUTO; Supplier 1: Mouser; Supplier Part Number 1: 80-C0402C330J9RAUTO; Mouser Part Number: 80-C0402C330J9RAUTO
D40 D41 D43-D45 D47 = Diode - LED (0402-Blue): as D29 on sheet Digital Port F State LED Inducator; Mouser_Part_Number: 755-SMLP13BC8TT86; ROHS: Yes; ComponentLink1Description: DataSheet; ComponentLink1URL: https://d1d2qsbl8m0m72.cloudfront.net/en/products/databook/datasheet/opto/led/chip_mono/sml-p1-e.pdf; ComponentLink2Description: Mouser; ComponentLink2URL: https://www.mouser.com.tr/ProductDetail/ROHM-Semiconductor/SMLP13BC8TT86?qs=%2Fha2pyFaduidYDgXFKL%252BNZwCVZNUI4FlyPWWbVDx1b6ABmzS%252BS2f0w%3D%3D; Supplier 1: Mouser; Supplier 2: Digi-Key; Supplier Part Number 1: 755-SMLP13BC8TT86; Supplier Part Number 2: 846-1112-1-ND
J11 = Connector - Male Header 6P (2.54): Headers & Wire Housings BREAKAWAY HDR VERT 6; Manufacturer Name: Molex; Position: 6; Row: 1; Pitch: 2.54 mm; Manufacturer Part Number: 22-28-4063; Mouser Part Number: 538-22-28-4063; ROHS: Yes; ComponentLink1Description: DataSheet; ComponentLink1URL: https://www.mouser.com.tr/datasheet/2/276/0022284063_PCB_HEADERS-228265.pdf; ComponentLink2Description: Mouser; ComponentLink2URL: https://www.mouser.com.tr/ProductDetail/Molex/22-28-4063?qs=sGAEpiMZZMs%252BGHln7q6pm%252BS0pk2Wo0XxVjxVgqsrZJ8%3D; Supplier 1: Mouser; Supplier 2: Digi-Key; Supplier Part Number 2: WM50016-06-ND; Supplier Part Number 1: 538-22-28-4063
Q36 Q37 Q39 Q40 Q42 Q43 = Transistor - BC847: as Q25-Q27 on sheet Digital Port F State LED Inducator; Mouser_Part_Number: 771-BC847AQAZ; ComponentLink1Description: DataSheet; ComponentLink1URL: https://www.mouser.com.tr/datasheet/2/916/BC847XQA_SER-1598405.pdf; ComponentLink2Description: Mouser; ComponentLink2URL: https://www.mouser.com.tr/ProductDetail/Nexperia/BC847AQAZ?qs=%2Fha2pyFaduhKMCPKNtQimeJpXTw9z4AqURd2YARs8DVICZNv3AT9Dw%3D%3D; Case: DFN-1010D-3; Supplier 1: Mouser; Supplier 2: Digi-Key; Supplier Part Number 1: 771-BC847AQAZ; Supplier Part Number 2: 1727-2545-1-ND
R90 R92 R95 R97 R100 R102 = Resistor - 330R: as R69 on sheet Digital Port F State LED Inducator; Height: 0.4mm; ComponentLink1Description: DataSheet; ComponentLink1URL: https://www.mouser.com.tr/datasheet/2/427/dcrcwe3-1762152.pdf; ComponentLink2Description: Mouser; ComponentLink2URL: https://www.mouser.com.tr/ProductDetail/Vishay-Dale/CRCW0402330RFKED?qs=sGAEpiMZZMu61qfTUdNhG2DpbjADlD3GGS6SwBlLi5Q%3D; Supplier 1: Mouser; Supplier 2: Digi-Key; Supplier Part Number 2: 541-330LCT-ND; Supplier Part Number 1: 71-CRCW0402-330-E3; Mouser Part Number: 71-CRCW0402-330-E3

## Sheet GSM Control Signals.SchDoc: GSM Control Signals
size A3; ApprovedBy: Mehmet Günce Akkoyun; CheckedBy: Mehmet Günce Akkoyun; Author: Mehmet Günce Akkoyun; CompanyName: Ovoo Electronics; DrawnBy: Mehmet Günce Akkoyun; Engineer: Mehmet Günce Akkoyun; Organization: Ovoo Electronics; Address1: Necip Fazýl Mah. Ortaýrmak Sok.; Address2: Birgül Apt. No: 19/6; Address3: Meram / Konya; Address4: Turkiye; DocumentNumber: AA001; Revision: B100AA Dev Kit
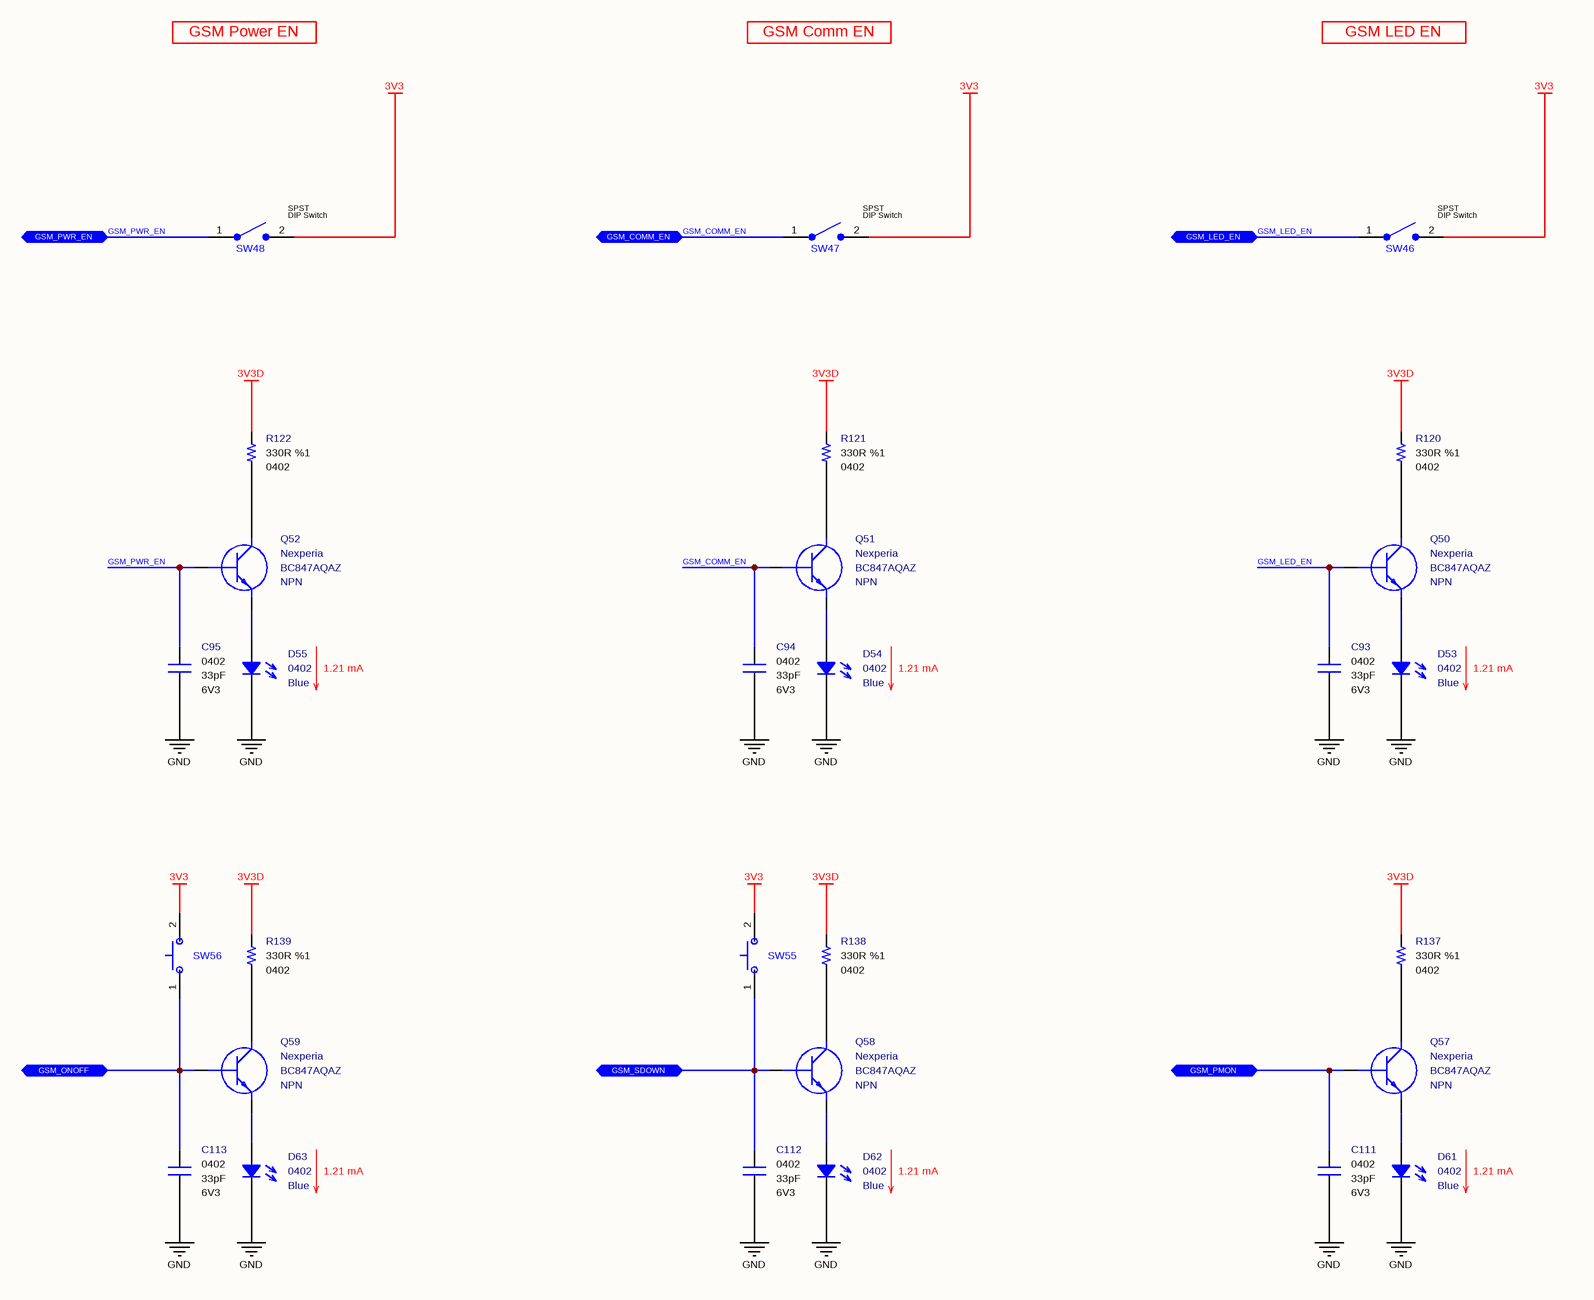
[diagram p24: GSM Control Signals.SchDoc]

### Parts
C93  value 33pF  Case: 0402  Voltage: 6V3  [CAPACITOR_0402]  (hidden comment: Multilayer Ceramic Capacitor)
C94  value 33pF  Case: 0402  Voltage: 6V3  [CAPACITOR_0402]  (hidden comment: Multilayer Ceramic Capacitor)
C95  value 33pF  Case: 0402  Voltage: 6V3  [CAPACITOR_0402]  (hidden comment: Multilayer Ceramic Capacitor)
C111  value 33pF  Case: 0402  Voltage: 6V3  [CAPACITOR_0402]  (hidden comment: Multilayer Ceramic Capacitor)
C112  value 33pF  Case: 0402  Voltage: 6V3  [CAPACITOR_0402]  (hidden comment: Multilayer Ceramic Capacitor)
C113  value 33pF  Case: 0402  Voltage: 6V3  [CAPACITOR_0402]  (hidden comment: Multilayer Ceramic Capacitor)
D53  Case: 0402  Color: Blue  [LED_0402]  (hidden comment: SMD LED (Blue))
D54  Case: 0402  Color: Blue  [LED_0402]  (hidden comment: SMD LED (Blue))
D55  Case: 0402  Color: Blue  [LED_0402]  (hidden comment: SMD LED (Blue))
D61  Case: 0402  Color: Blue  [LED_0402]  (hidden comment: SMD LED (Blue))
D62  Case: 0402  Color: Blue  [LED_0402]  (hidden comment: SMD LED (Blue))
D63  Case: 0402  Color: Blue  [LED_0402]  (hidden comment: SMD LED (Blue))
Q50  Manufacturer_Name: Nexperia  Manufacturer_Part_Number: BC847AQAZ  Polarity: NPN  [SOT1215]  (hidden comment: Bipolar NPN Transistors)
Q51  Manufacturer_Name: Nexperia  Manufacturer_Part_Number: BC847AQAZ  Polarity: NPN  [SOT1215]  (hidden comment: Bipolar NPN Transistors)
Q52  Manufacturer_Name: Nexperia  Manufacturer_Part_Number: BC847AQAZ  Polarity: NPN  [SOT1215]  (hidden comment: Bipolar NPN Transistors)
Q57  Manufacturer_Name: Nexperia  Manufacturer_Part_Number: BC847AQAZ  Polarity: NPN  [SOT1215]  (hidden comment: Bipolar NPN Transistors)
Q58  Manufacturer_Name: Nexperia  Manufacturer_Part_Number: BC847AQAZ  Polarity: NPN  [SOT1215]  (hidden comment: Bipolar NPN Transistors)
Q59  Manufacturer_Name: Nexperia  Manufacturer_Part_Number: BC847AQAZ  Polarity: NPN  [SOT1215]  (hidden comment: Bipolar NPN Transistors)
R120  value 330R  Tolerance: %1  Case: 0402  [RESISTOR_0402]  (hidden comment: Thick Film Resistor)
R121  value 330R  Tolerance: %1  Case: 0402  [RESISTOR_0402]  (hidden comment: Thick Film Resistor)
R122  value 330R  Tolerance: %1  Case: 0402  [RESISTOR_0402]  (hidden comment: Thick Film Resistor)
R137  value 330R  Tolerance: %1  Case: 0402  [RESISTOR_0402]  (hidden comment: Thick Film Resistor)
R138  value 330R  Tolerance: %1  Case: 0402  [RESISTOR_0402]  (hidden comment: Thick Film Resistor)
R139  value 330R  Tolerance: %1  Case: 0402  [RESISTOR_0402]  (hidden comment: Thick Film Resistor)
SW46  DIP Switch  [DS04-254-2-01BK-SMT-TR]  (value not drawn)
SW47  DIP Switch  [DS04-254-2-01BK-SMT-TR]  (value not drawn)
SW48  DIP Switch  [DS04-254-2-01BK-SMT-TR]  (value not drawn)
SW55  Tactile Switches  [PTS526_Switch]  (value not drawn)
SW56  Tactile Switches  [PTS526_Switch]  (value not drawn)

### Ports
GSM_COMM_EN (bidir), GSM_LED_EN (bidir), GSM_ONOFF (bidir), GSM_PMON (bidir), GSM_PWR_EN (bidir), GSM_SDOWN (bidir)

### Nets
3V3: SW46.2(NO) SW47.2(NO) SW48.2(NO) SW55.2(COM) SW56.2(COM)
3V3D: R120.2 R121.2 R122.2 R137.2 R138.2 R139.2
GND: C93.2 C94.2 C95.2 C111.2 C112.2 C113.2 D53.1 D54.1 D55.1 D61.1 D62.1 D63.1
GSM_COMM_EN: C94.1 Q51.1(B) SW47.1(COM) ; port GSM_COMM_EN
GSM_LED_EN: C93.1 Q50.1(B) SW46.1(COM) ; port GSM_LED_EN
GSM_PWR_EN: C95.1 Q52.1(B) SW48.1(COM) ; port GSM_PWR_EN
NetC111_1: C111.1 Q57.1(B) ; port GSM_PMON
NetC112_1: C112.1 Q58.1(B) SW55.1(NC) ; port GSM_SDOWN
NetC113_1: C113.1 Q59.1(B) SW56.1(NC) ; port GSM_ONOFF
NetD53_2: D53.2 Q50.2(E)
NetD54_2: D54.2 Q51.2(E)
NetD55_2: D55.2 Q52.2(E)
NetD61_2: D61.2 Q57.2(E)
NetD62_2: D62.2 Q58.2(E)
NetD63_2: D63.2 Q59.2(E)
NetQ50_3: Q50.3(C) R120.1
NetQ51_3: Q51.3(C) R121.1
NetQ52_3: Q52.3(C) R122.1
NetQ57_3: Q57.3(C) R137.1
NetQ58_3: Q58.3(C) R138.1
NetQ59_3: Q59.3(C) R139.1

### Notes on the sheet
- GSM Power EN
- GSM Comm EN
- GSM LED EN
- 1.21 mA
- Title
- Size:
- Date:
- A3
- Number:
- Time:
- Revision:
- Sheet
- of
- File:
- (in symbol Switch - DIP Switch (1 Pole)) SPST

### Library data of the parts
C93-C95 C111-C113 = Capacitor - 33pF [0402-6V3]: Capacitor - 33pF [0402] (Ceramic); Manufacturer Name: Kemet; Manufacturer Part Number: C0402C330J9RACAUTO; Dielectric: X7R; Tolerance: 10%; Height: 0.5mm; Maximum Operating Temperature: +125; Minimum Operating Temperature: -55; ROHS: Yes; ComponentLink1Description: DataSheet; ComponentLink1URL: https://api.kemet.com/component-edge/download/datasheet/C0402C330J9RACAUTO.pdf; ComponentLink2Description: Mouser; ComponentLink2URL: https://www.mouser.com/Search/Refine.aspx?Keyword=80-C0402C330J9RAUTO; Supplier 1: Mouser; Supplier Part Number 1: 80-C0402C330J9RAUTO; Mouser Part Number: 80-C0402C330J9RAUTO
D53-D55 D61-D63 = Diode - LED (0402-Blue): Standard LEDs - SMD PICOLEDTM;BLUE LED; 25M @ 5MA; Manufacturer_Name: ROHM Semiconductor; Manufacturer_Part_Number: SMLP13BC8TT86; Mouser_Part_Number: 755-SMLP13BC8TT86; ROHS: Yes; ComponentLink1Description: DataSheet; ComponentLink1URL: https://d1d2qsbl8m0m72.cloudfront.net/en/products/databook/datasheet/opto/led/chip_mono/sml-p1-e.pdf; ComponentLink2Description: Mouser; ComponentLink2URL: https://www.mouser.com.tr/ProductDetail/ROHM-Semiconductor/SMLP13BC8TT86?qs=%2Fha2pyFaduidYDgXFKL%252BNZwCVZNUI4FlyPWWbVDx1b6ABmzS%252BS2f0w%3D%3D; Supplier 1: Mouser; Supplier 2: Digi-Key; Supplier Part Number 1: 755-SMLP13BC8TT86; Supplier Part Number 2: 846-1112-1-ND
Q50-Q52 Q57-Q59 = Transistor - BC847: Bipolar Transistors - BJT BC847AQA/DFN1010D-3/REEL 7" Q2; Mouser_Part_Number: 771-BC847AQAZ; ComponentLink1Description: DataSheet; ComponentLink1URL: https://www.mouser.com.tr/datasheet/2/916/BC847XQA_SER-1598405.pdf; ComponentLink2Description: Mouser; ComponentLink2URL: https://www.mouser.com.tr/ProductDetail/Nexperia/BC847AQAZ?qs=%2Fha2pyFaduhKMCPKNtQimeJpXTw9z4AqURd2YARs8DVICZNv3AT9Dw%3D%3D; Case: DFN-1010D-3; Supplier 1: Mouser; Supplier 2: Digi-Key; Supplier Part Number 1: 771-BC847AQAZ; Supplier Part Number 2: 1727-2545-1-ND
R120-R122 R137-R139 = Resistor - 330R: Thick Film Resistors - SMD 1/16 W 330 Ohm 1%; Manufacturer Name: Vishay; Manufacturer Part Number: CRCW0402330RFKED; Height: 0.4mm; ComponentLink1Description: DataSheet; ComponentLink1URL: https://www.mouser.com.tr/datasheet/2/427/dcrcwe3-1762152.pdf; ComponentLink2Description: Mouser; ComponentLink2URL: https://www.mouser.com.tr/ProductDetail/Vishay-Dale/CRCW0402330RFKED?qs=sGAEpiMZZMu61qfTUdNhG2DpbjADlD3GGS6SwBlLi5Q%3D; Supplier 1: Mouser; Supplier 2: Digi-Key; Supplier Part Number 2: 541-330LCT-ND; Supplier Part Number 1: 71-CRCW0402-330-E3; Mouser Part Number: 71-CRCW0402-330-E3
SW46-SW48 = Switch - DIP Switch (1 Pole): DIP Switches/SIP Switches DIP Switch, SPST, 2.54 pitch, flat actuator, SMT, Tape and reel, 1 position, Black; Manufacturer Name: CUI Devices; Manufacturer Part Number: DS04-254-2-01BK-SMT-TR; Mouser Part Number: 490-DS04254201BK-STR; ComponentLink1Description: DataSheet; ComponentLink1URL: https://www.mouser.com.tr/datasheet/2/670/ds04_254_smt-1777718.pdf; ComponentLink2Description: Mouser; ComponentLink2URL: https://www.mouser.com.tr/ProductDetail/CUI-Devices/DS04-254-2-01BK-SMT-TR/?qs=%2Fha2pyFadujy0kBXqTx%252B7K4ZqypoI1xcyUu3ptD5LL%252BAwZdjUHFG%252BXP1ryAUxmHU; Supplier 1: RSComponents; Supplier 2: Arrow Electronics; Supplier 3: Farnell; Supplier 4: Newark; Supplier 5: Digi-Key; Supplier Part Number 1: 6820986; Supplier Part Number 2: A6S-1104-H; Supplier Part Number 3: 1960892; Supplier Part Number 4: 83T2298; Supplier Part Number 5: Z5187-ND
SW55 SW56 = Switch - Tactile: Tactile Switches 50mA 12VDC, 5.2x5.2mm, 0.8mm H, 260gf, G leads.; Manufacturer Name: C&K Switches; Manufacturer Part Number: PTS526 SK08 SMTR2 LFS; Height: 0.8mm; Mouser Part Number: 611-PTS526SK08SMTR2L; ComponentLink1Description: DataSheet; ComponentLink1URL: https://eu.mouser.com/datasheet/2/60/pts526-1651200.pdf; ComponentLink2Description: Mouser; ComponentLink2URL: https://eu.mouser.com/ProductDetail/CK/PTS526-SK08-SMTR2-LFS?qs=sGAEpiMZZMsgGjVA3toVBL%2FRce%252ByN3s1hQPqiLlQ%252BeM%3D; Supplier 1: Future Electronics; Supplier 2: Mouser; Supplier 3: Arrow; Supplier 4: Digi-Key; Supplier Part Number 1: PTS526SK08SMTR2LFS-REEL; Supplier Part Number 2: 611-PTS526SK08SMTR2L; Supplier Part Number 3: PTS526 SK08 SMTR2 LFS; Supplier Part Number 4: CKN12219-1-ND